# EAGLE design controller12 (EAGLE 8.3.1)

## Sheet 1 of 2
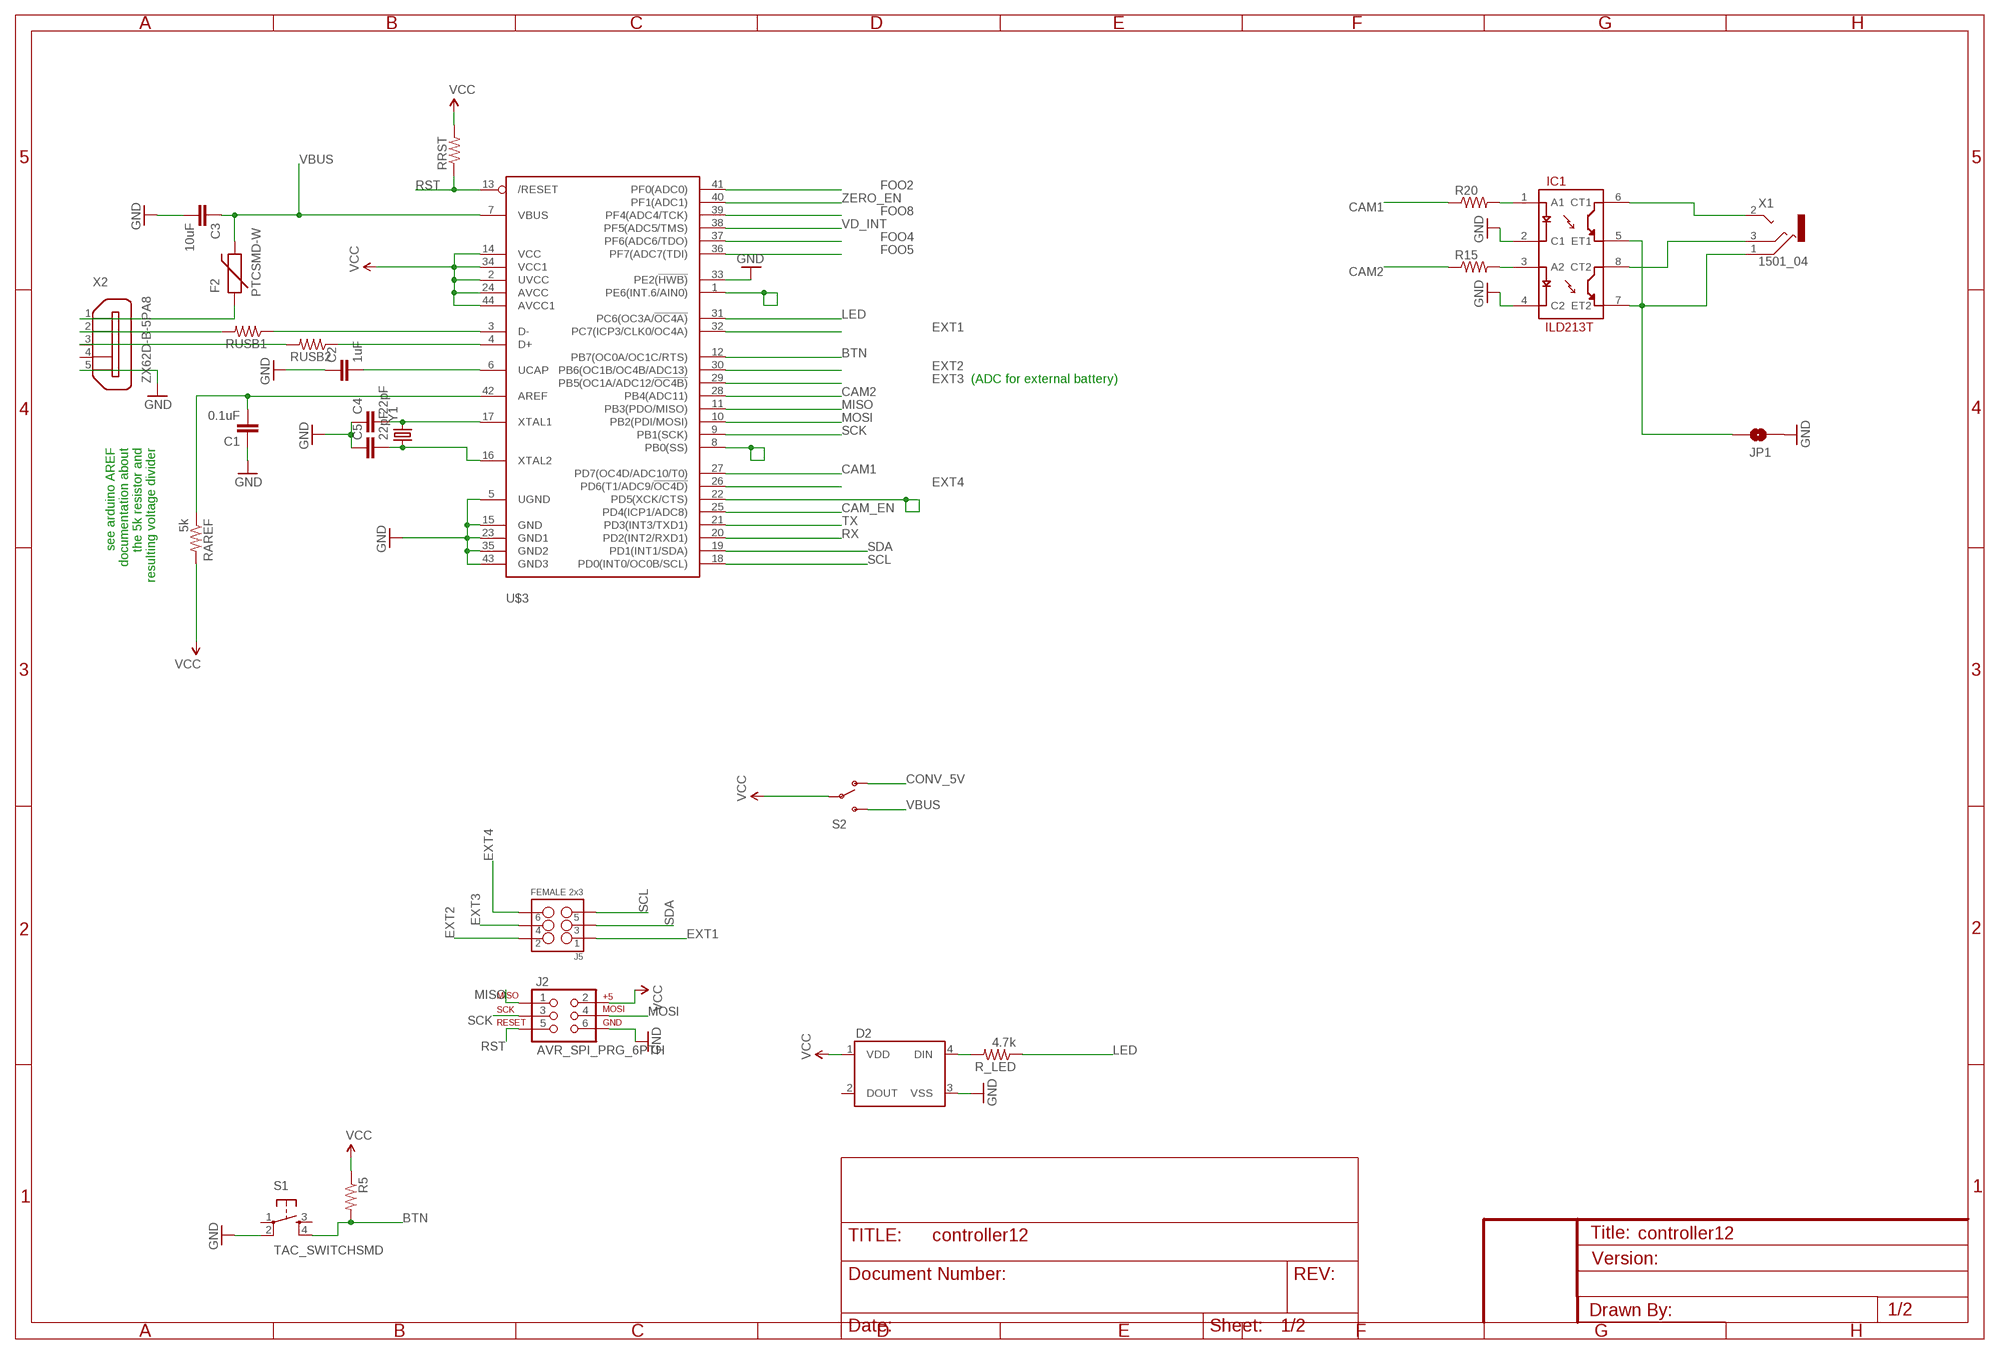
[diagram p0: schematic, sheet 1]

### Parts
C1  0.1uF  CAP1206  [1206]
C2  1uF  CAP1206  [1206]
C3  10uF  CAP1206  [1206]
C4  22pF  CAP1206  [1206]
C5  22pF  CAP1206  [1206]
D2  WS2812B  [WS2812B]
F2  PTCSMD-W  [PTC-1206-WIDE]
IC1  ILD213T  [SO08]
J2  AVR_SPI_PRG_6PTH  [2X3]
J5  FEMALE 2x3  M03X2FEMALE  [2X3]
JP1  JUMPER-PAD-2-NOYES_SILK  [PAD-JUMPER-2-NO_YES_SILK]
R5  RESISTOR1206  [1206]
R15  RESISTOR1206  [1206]
R20  RESISTOR1206  [1206]
R_LED  4.7k  RESISTOR1206  [1206]
RAREF  5k  RESISTOR1206  [1206]
RRST  RESISTOR1206  [1206]
RUSB1  RESISTOR1206  [1206]
RUSB2  RESISTOR1206  [1206]
S1  TAC_SWITCHSMD  TAC_SWITCHPTH  [TACTILE-PTH]
S2  SWITCH-SPDTSMD2  [SWITCH-SPDT-SMD]
U$3  ATMEGA32U4-AU  [TQFP44]
X1  1501_04  [1501_05]
X2  ZX62D-B-5PA8  [ZX62D-B-5PA8]
Y1  CRYSTALCRYSTAL-SMD-5X3-16MHZ  [CRYSTAL-SMD-5X3]

### Nets
BTN: R5.2 S1.4 U$3.12(PB7(OC0A/OC1C/RTS))
CAM1: R20.1 U$3.27(PD7(OC4D/ADC10/T0))
CAM2: R15.1 U$3.28(PB4(ADC11))
CAM_EN: U$3.25(PD4(ICP1/ADC8)) ; also sheet 2
CONV_5V [power]: S2.1(O) ; also sheet 2
EXT1: J5.1 U$3.32(PC7(ICP3/CLK0/OC4A))
EXT2: J5.2 U$3.30(PB6(OC1B/OC4B/ADC13))
EXT3: J5.4 U$3.29(PB5(OC1A/ADC12/!OC4B))
EXT4: J5.6 U$3.26(PD6(T1/ADC9/!OC4D))
FOO2: U$3.41(PF0(ADC0))
FOO4: U$3.37(PF6(ADC6/TDO))
FOO5: U$3.36(PF7(ADC7(TDI))
FOO8: U$3.39(PF4(ADC4/TCK))
GND: C1.1 C2.1 C3.2 C4.1 C5.1 D2.3(VSS) IC1.2(C1) IC1.4(C2) J2.6 JP1.1 S1.2 U$3.5(UGND) U$3.15(GND) U$3.23(GND1) U$3.33(PE2(!HWB)) U$3.35(GND2) U$3.43(GND3) X2.5 ; also sheet 2
LED: R_LED.1 U$3.31(PC6(OC3A/!OC4A))
MISO: J2.1 U$3.11(PB3(PDO/MISO))
MOSI: J2.4 U$3.10(PB2(PDI/MOSI))
N$4: RUSB1.1 U$3.3(D-)
N$5: RUSB2.1 U$3.4(D+)
N$7: D2.4(DIN) R_LED.2
N$8: C4.2 U$3.17(XTAL1) Y1.3
N$9: C5.2 U$3.16(XTAL2) Y1.1
N$10: RUSB1.2 X2.2
N$11: RUSB2.2 X2.3
N$12: IC1.6(CT1) X1.2
N$13: IC1.8(CT2) X1.3
N$14: U$3.8(PB0(SS))
N$15: IC1.3(A2) R15.2
N$16: U$3.1(PE6(INT.6/AIN0))
N$17: U$3.22(PD5(XCK/CTS))
N$18 [power]: C1.2 RAREF.1 U$3.42(AREF)
N$19: IC1.1(A1) R20.2
N$20: C2.2 U$3.6(UCAP)
N$34: IC1.5(ET1) IC1.7(ET2) JP1.2 X1.1
N$38: F2.1 X2.1
RST: J2.5 RRST.1 U$3.13(/RESET)
RX: U$3.20(PD2(INT2/RXD1)) ; also sheet 2
SCK: J2.3 U$3.9(PB1(SCK))
SCL: J5.5 U$3.18(PD0(INT0/OC0B/SCL))
SDA: J5.3 U$3.19(PD1(INT1/SDA))
TX: U$3.21(PD3(INT3/TXD1)) ; also sheet 2
VBUS: C3.1 F2.2 S2.3(S) U$3.7(VBUS)
VCC [power]: D2.1(VDD) J2.2 R5.1 RAREF.2 RRST.2 S2.2(P) U$3.2(UVCC) U$3.14(VCC) U$3.24(AVCC) U$3.34(VCC1) U$3.44(AVCC1) ; also sheet 2
VD_INT: U$3.38(PF5(ADC5/TMS)) ; also sheet 2
ZERO_EN: U$3.40(PF1(ADC1)) ; also sheet 2
Unconnected: D2.2(DOUT) S1.1 S1.3 X2.4 X2.S1 X2.S2 X2.S3 X2.S4

### Notes on the sheet
- (ADC for external battery)
- see arduino AREF
  documentation about
  the 5k resistor and
  resulting voltage divider

## Sheet 2 of 2
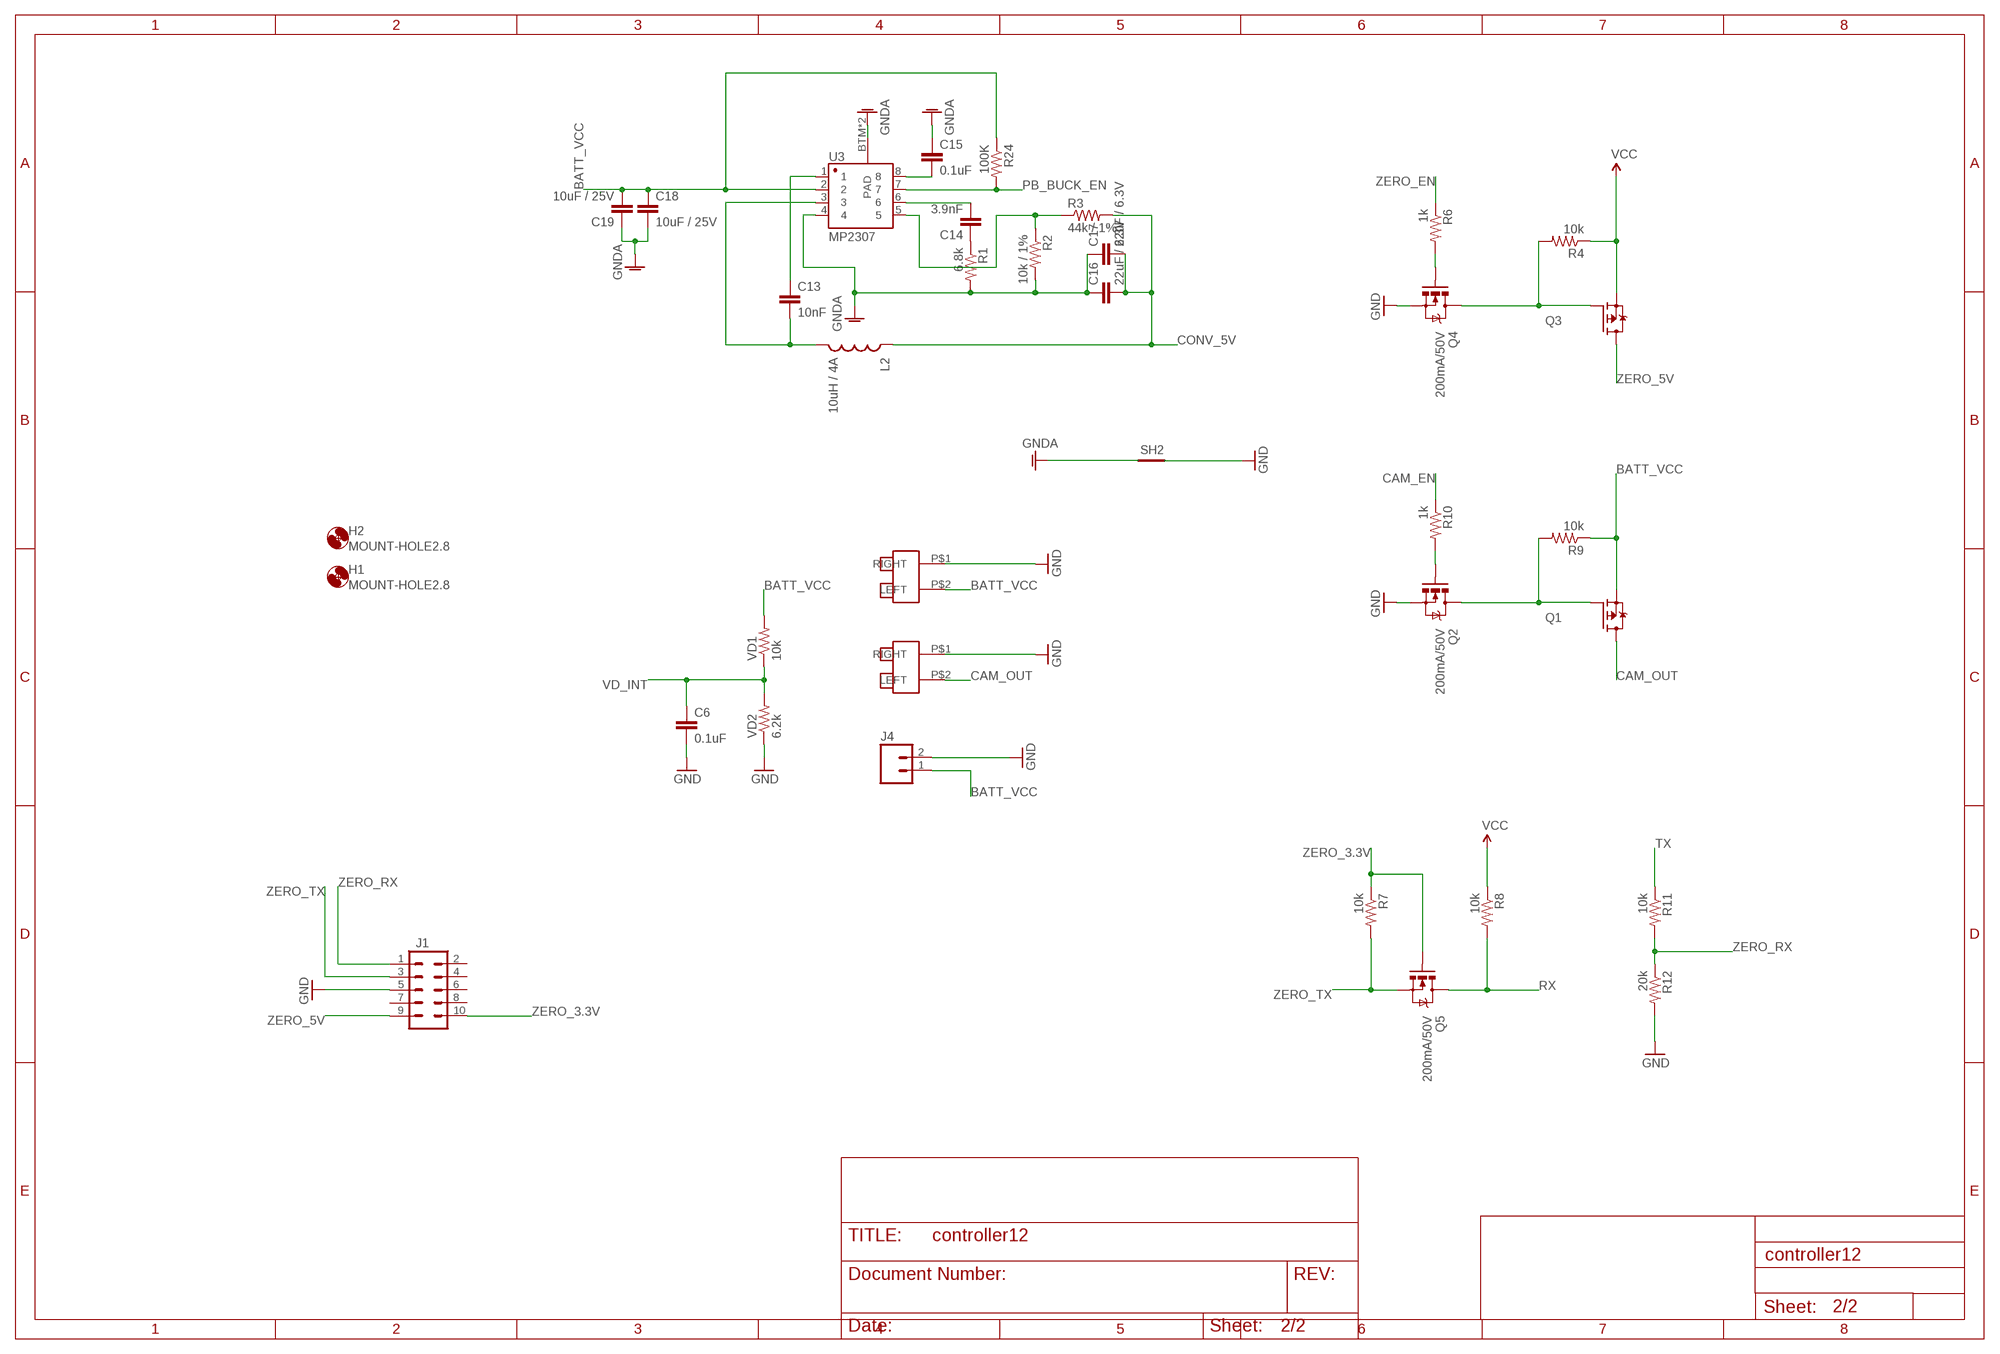
[diagram p1: schematic, sheet 2]

### Parts
C6  0.1uF  CAP1206  [1206]
C13  10nF  CAP1206  [1206]
C14  3.9nF  CAP1206  [1206]
C15  0.1uF  CAP1206  [1206]
C16  22uF / 6.3V  CAP1210  [1210]
C17  22uF / 6.3V  CAP1210  [1210]
C18  10uF / 25V  CAP1210  [1210]
C19  10uF / 25V  CAP1210  [1210]
H1  MOUNT-HOLE2.8  [2,8]
H2  MOUNT-HOLE2.8  [2,8]
J1  M05X2PTH  [AVR_ICSP]
J4  M02PTH  [1X02]
L2  10uH / 4A  INDUCTORSRU1038  [SRU1038]
Q1  FDD4141TO252  [TO252]
Q2  200mA/50V  MOSFET-NCHANNELBSS138  [SOT23-3]
Q3  FDD4141TO252  [TO252]
Q4  200mA/50V  MOSFET-NCHANNELBSS138  [SOT23-3]
Q5  200mA/50V  MOSFET-NCHANNELBSS138  [SOT23-3]
R1  6.8k  RESISTOR1206  [1206]
R2  10k / 1%  RESISTOR1206  [1206]
R3  44k / 1%  RESISTOR1206  [1206]
R4  10k  RESISTOR1206  [1206]
R6  1k  RESISTOR1206  [1206]
R7  10k  RESISTOR1206  [1206]
R8  10k  RESISTOR1206  [1206]
R9  10k  RESISTOR1206  [1206]
R10  1k  RESISTOR1206  [1206]
R11  10k  RESISTOR1206  [1206]
R12  20k  RESISTOR1206  [1206]
R24  100K  RESISTOR1206  [1206]
SH2  SHORT-HT5  [SHORT_TOP-50]
U3  MP2307  GENERIC-SOIC8MSGEQ7N-FILTER  [SO08]
U$4  NANOFIT2  [NANOFIT2]
U$5  NANOFIT2  [NANOFIT2]
VD1  10k  RESISTOR1206  [1206]
VD2  6.2k  RESISTOR1206  [1206]

### Nets
BATT_VCC [camera_power]: C18.1 C19.2 J4.1 Q1.2(S) R9.1 R24.1 U3.2 U$4.P$2(LEFT) VD1.2
CAM_EN: R10.1 ; also sheet 1
CAM_OUT [camera_power]: Q1.3(D) U$5.P$2(LEFT)
CONV_5V [power]: C16.2 C17.2 L2.1 R3.2 ; also sheet 1
GND: C6.2 J1.5 J4.2 Q2.2(S) Q4.2(S) R12.2 SH2.2 U$4.P$1(RIGHT) U$5.P$1(RIGHT) VD2.1 ; also sheet 1
GNDA [power]: C15.1 C16.1 C17.1 C18.2 C19.1 R1.2 R2.2 SH2.1 U3.4 U3.BTM(PAD) U3.P$1(PAD)
N$1: Q1.1(G) Q2.3(D) R9.2
N$2: Q4.1(G) R6.2
N$3: Q3.1(G) Q4.3(D) R4.2
N$6: Q2.1(G) R10.2
N$25: C15.2 U3.8
N$26 [power]: C13.2 L2.2 U3.3
N$27: C13.1 U3.1
N$28: C14.1 R1.1
N$29: C14.2 U3.6
N$30: R2.1 R3.1 U3.5
PB_BUCK_EN: R24.2 U3.7
RX: Q5.3(D) R8.2 ; also sheet 1
TX: R11.1 ; also sheet 1
VCC [power]: Q3.2(S) R4.1 R8.1 ; also sheet 1
VD_INT: C6.1 VD1.1 VD2.2 ; also sheet 1
ZERO_3.3V: J1.10 Q5.1(G) R7.1
ZERO_5V [power]: J1.9 Q3.3(D)
ZERO_EN: R6.1 ; also sheet 1
ZERO_RX: J1.1 R11.2 R12.1
ZERO_TX: J1.3 Q5.2(S) R7.2
Unconnected: J1.2 J1.4 J1.6 J1.7 J1.8

## Library data of the parts
C1 C2 C6 C13-C19 = SparkFun-Capacitors:CAP: Capacitor Standard 0603 ceramic capacitor, and 0.1" leaded capacitor.
C3-C5 = SparkFun-Passives:CAP: Capacitor Standard 0603 ceramic capacitor, and 0.1" leaded capacitor.
D2 = SparkFun-LED:WS2812B: WS2812B - Intelligent control LED integrated light source Technical Specifications: Power Supply Voltage (VDD): 3.5 to 5.3 V Input Voltage (VI): -0.5 to VDD+0.5 V Operating Junction Temperature (Topt): -25°C to +80°C Storage Temperature Range (Tstg): -55°C to +150°C; PROD_ID: DIO-12503
F2 = SparkFun-PowerIC:PTC: Resettable Fuse PTC Resettable Fuse. Spark Fun Electronics SKU : COM-08357
H1 H2 = holes:MOUNT-HOLE: MOUNTING HOLE with drill center marker
IC1 = SparkFun-DiscreteSemi:ILD213T: Dual optoisolator.
J1 = SparkFun-Connectors:M05X2: Header 5x2 Standard 10-pin dual row 0.1" header. Commonly used with AVR-ISP. Use with Spark Fun Electronics SKU: PRT-00778
J2 = SparkFun-Connectors:AVR_SPI_PRG_6: AVR ISP 6 Pin This is the reduced ISP connector for AVR programming. Common on Arduino. This footprint will take up less PCB space and can be used with a 10-pin to 6-pin adapter such as SKU: BOB-08508 **Special note about "TEST_POINT" package. The stop mask is on the top side, so if you want your programming test points to be on the bottom of your board, make sure to place this package on the bottom side of the board. This also ensure that the orientation to program from the bottom side will be correct.
J4 = SparkFun-Connectors:M02: Standard 2-pin 0.1" header. Use with - straight break away headers ( PRT-00116) - right angle break away headers (PRT-00553) - swiss pins (PRT-00743) - machine pins (PRT-00117) - female headers (PRT-00115) Molex polarized connector foot print use with: PRT-08233 with associated crimp pins and housings. 2.54_SCREWTERM for use with PRT-10571. 3.5mm Screw Terminal footprints for PRT-08084 5mm Screw Terminal footprints for use with PRT-08432
J5 = SparkFun-Connectors:M03X2: 2x3 .1" header. Shrouded, with keying- CONN-10681 SMT- CONN-11415 Pogo pins- HW-11044; PROD_ID: CONN-11566
JP1 = SparkFun-Passives:JUMPER-PAD-2-NO
L2 = SparkFun-Passives:INDUCTOR: Inductors Basic Inductor/Choke - 0603 and 1206. Footprints are not proven and vary greatly between part numbers. INDUCTOR POWER 3.3UH 4.0A SMD 0.197" L x 0.197" W x 0.177" H (5.00mm x 5.00mm x 4.50mm)
Q1 Q3 = transistor-fet:FDD4141: P-Channel PowerTrench® MOSFET Source: FDD4141.pdf
Q2 Q4 Q5 = SparkFun-DiscreteSemi:MOSFET-NCHANNEL: Common NMOSFET Parts MFG P/N Store ID Prod ID FDD8780 TRANS-09984 SI7820DN TRANS-11055 FDS6630A IC-08089 2N7002PW TRANS-11151 FQP30N06L COM-10213 TRANS-10060 BSS123LT1G TRANS-08345 BSS138 TRANS-00830 BS170 2N7000; PROD_ID: TRANS-00830
R1-R4 R6-R12 R24 R_LED = SparkFun-Resistors:RESISTOR: Resistor Basic schematic elements and footprints for 0603, 1206, and PTH resistors.
R5 R15 R20 RAREF RRST RUSB1 RUSB2 VD1 VD2 = SparkFun-Passives:RESISTOR: Resistor Basic schematic elements and footprints for 0603, 1206, and PTH resistors.
S1 = SparkFun-Retired:TAC_SWITCH: Momentary Switch Button commonly used for reset or general input. Spark Fun Electronics SKU : COM-00097 SMT- SWCH-08247
S2 = SparkFun-Electromechanical:SWITCH-SPDT: SPDT Switch Simple slide switch, Spark Fun Electronics SKU : COM-00102 DPDT SMT slide switch, AYZ0202, SWCH-08179
SH2 = shorts:SHORT-H: Short between two nets; BOM: no
U3 = SparkFun-AnalogIC:GENERIC-SOIC8: A placeholder for generic narrow & wide SOIC8 foorptints - used on the DIP adapter board.; PROD_ID: IC-10141
U$3 = adafruit:ATMEGA32U4: http://www.ladyada.net/library/eagle
U$4 U$5 = volzolib:NANOFIT2
X1 = con-lumberg:1501_0*: Jack connectors according to JISC 6560, 2.5 mm Klinkensteckverbinder nach JISC 6560, 2,5 mm Source: http://www.lumberg.com/Produkte/PDFs/1501_05.pdfedit 1501_03 http://www.lumberg.com/Produkte/PDFs/1501_06.pdf; OC_FARNELL: 1216977; OC_NEWARK: unknown
X2 = zx62d-b-5pa8-oshpark_10:ZX62D-B-5PA8: Micro USB Type B Connector - Standard, Shell Through Hole Source: http://www.hirose.co.jp/cataloge_hp/ed_ZX_20140804.pdf; MF: Hirose; MPN: ZX62D-B-5PA8; OC_FARNELL: 2300438; OC_NEWARK: 69W0712
Y1 = SparkFun-FreqCtrl:CRYSTAL: Various standard crystals. Proven footprints.; PROD_ID: XTAL-08218

## Net classes
0 default: width 0.254 mm, clearance 0.254 mm
1 power: width 0.381 mm, clearance 0.254 mm
2 camera_power: width 0.66 mm, clearance 0.254 mm
3 usbsignal: width 0.254 mm, clearance 0.203 mm

## Board
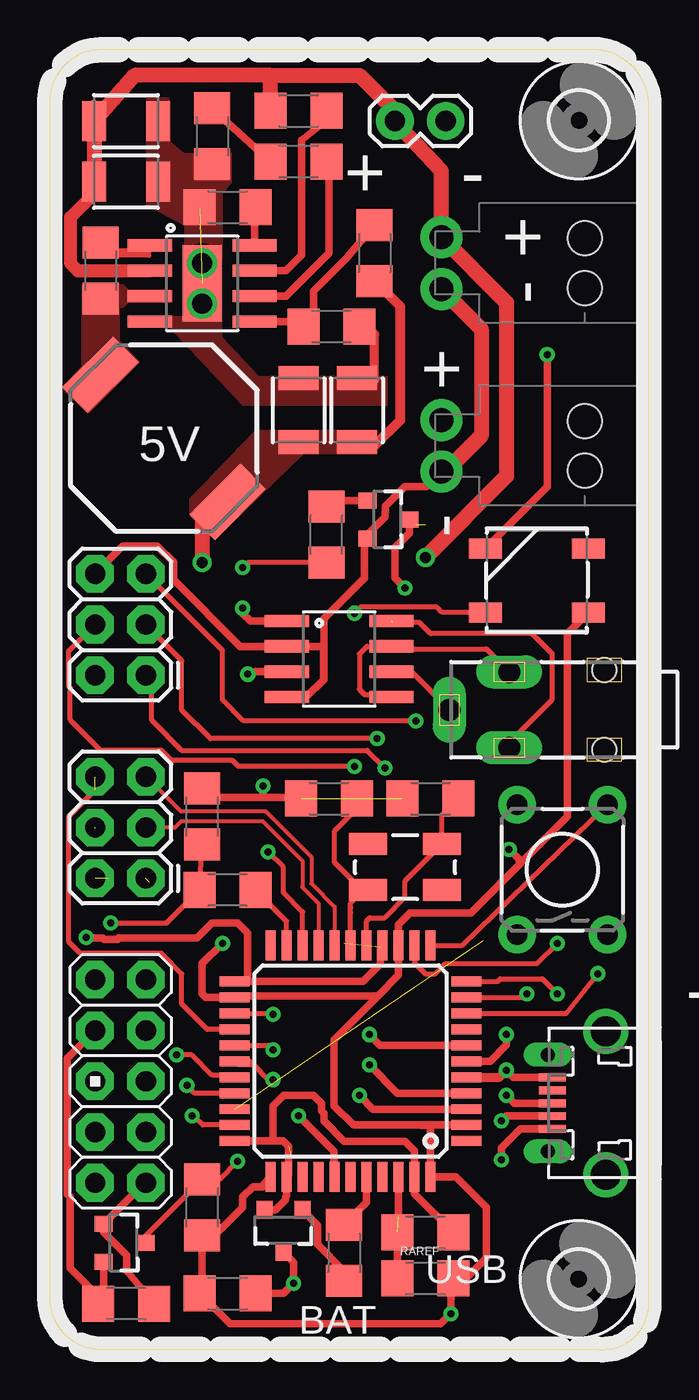
[diagram p2: board, top side]
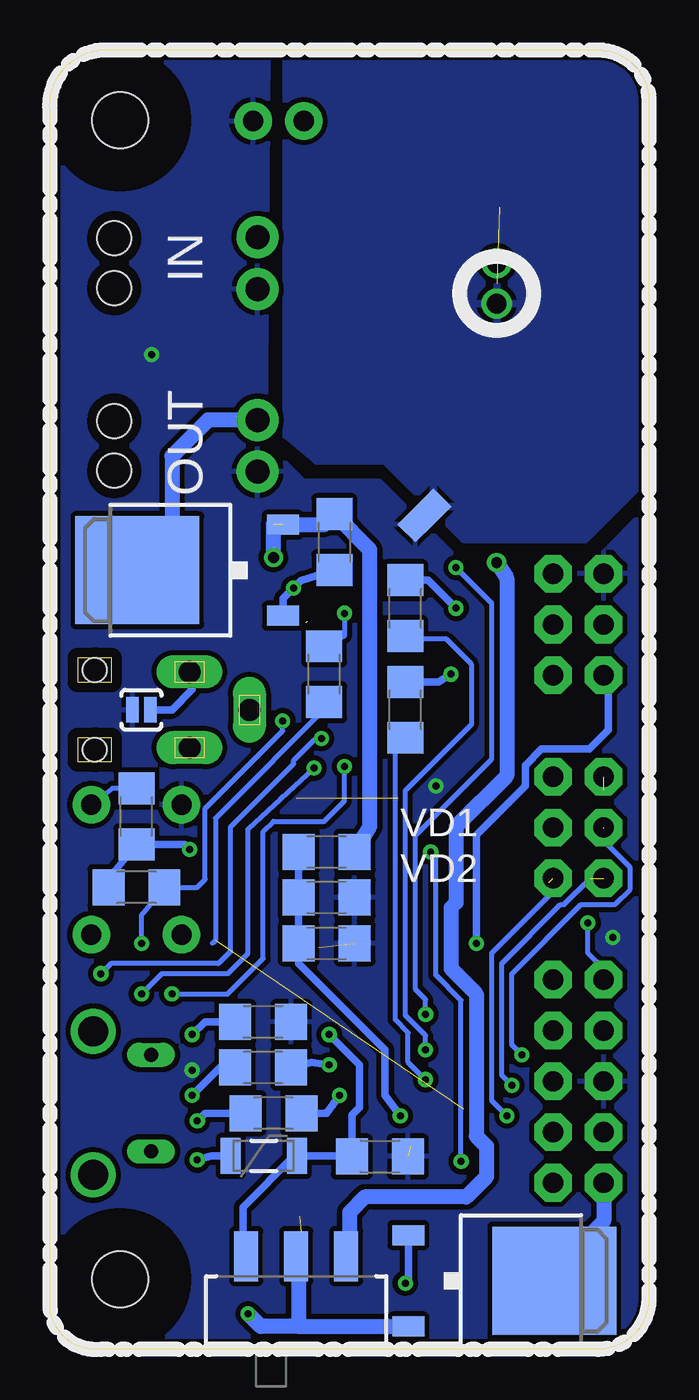
[diagram p3: board, bottom side, seen from below]

Size 29.98 x 65.04 mm. Coordinates in mm from the lower left corner, seen from the top.
Outline: 0,2.55 arc90 2.54,0.01 27.43,0.01 arc90 29.97,2.05 29.97,61.99 arc90 27.43,65.04 2.54,65.04 arc90 0,62.5 0,2.55
Copper layers (1*16): Top 0.035mm / dielectric 1.5mm / Bottom 0.035mm
Design rules "default *": minimum track width 10mil, minimum drill 24mil, track to track 8mil, track to pad 8mil, pad to pad 8mil, via to via 8mil, smd to smd 8mil, copper to edge 20mil, drill to drill 8mil, minimum pad ring 10mil, minimum via ring 8mil, stop-mask expansion 4mil, vias tented up to drill 0mil, thermal gap 10mil

### Footprints (pad centres in the part's own frame; a part is rotated, then mirrored left to right if it is on the bottom)
1206 = smd 1.6 x 1.8: 1 -1.4,0; 2 1.4,0
1210 = smd 1.2 x 2: 1 -1.6,0; 2 1.6,0
WS2812B = smd 1.651 x 1: 1 -2.577,1.6; 2 -2.577,-1.6; 3 2.577,-1.6; 4 2.577,1.6
PTC-1206-WIDE = smd 1 x 1.8: 1 -1.654,0; 2 1.654,0
2,8 = hole 2.8: 0,0
SO08 = smd 0.61 x 2.21: 1 -1.905,-2.616; 2 -0.635,-2.616; 3 0.635,-2.616; 4 1.905,-2.616; 5 1.905,2.616; 6 0.635,2.616; 7 -0.635,2.616; 8 -1.905,2.616
AVR_ICSP = drill 1.016 pad 1.88 octagon: 1 -1.27,5.08; 2 1.27,5.08; 3 -1.27,2.54; 4 1.27,2.54; 5 -1.27,0; 6 1.27,0; 7 -1.27,-2.54; 8 1.27,-2.54; 9 -1.27,-5.08; 10 1.27,-5.08
2X3 = drill 1.016 pad 1.88 octagon: 1 0,0; 2 0,2.54; 3 2.54,0; 4 2.54,2.54; 5 5.08,0; 6 5.08,2.54
1X02 = drill 1.016 pad 1.88: 1 0,0; 2 2.54,0
PAD-JUMPER-2-NO_YES_SILK = smd 0.635 x 1.27: 1 -0.45,0; 2 0.45,0
SRU1038 = smd 1.8 x 3.6: 1 -4.5,0; 2 4.5,0
TO252 = smd 1 x 1.6: 1 -2.28,-4.8; 2 2.28,-4.8 | smd 5.4 x 6.2: 3 0,2.5
SOT23-3 = smd 0.8 x 0.9: 1 -0.95,-1; 2 0.95,-1; 3 0,1.1
TACTILE-PTH = drill 1.016 pad 1.88: 1 -3.251,2.261; 2 3.251,2.261; 3 -3.251,-2.261; 4 3.251,-2.261
SWITCH-SPDT-SMD = smd 1.2 x 2.5: 1 -2.5,-2.75; 2 0,-2.75; 3 2.5,-2.75
SHORT_TOP-50 = smd 1.27 x 1.27: 1 0.635,0; 2 -0.635,0
SO08' = smd 0.61 x 2.21: 1 -1.905,-2.616; 2 -0.635,-2.616; 3 0.635,-2.616; 4 1.905,-2.616; 5 1.905,2.616; 6 0.635,2.616; 7 -0.635,2.616; 8 -1.905,2.616 | smd 3.81 x 1.93: BTM 0,0 | drill 1: P$1 1.016,0; P$2 -1.016,0
TQFP44 = smd 1.5 x 0.5: 1 -5.8,4; 2 -5.8,3.2; 3 -5.8,2.4; 4 -5.8,1.6; 5 -5.8,0.8; 6 -5.8,0; 7 -5.8,-0.8; 8 -5.8,-1.6; 9 -5.8,-2.4; 10 -5.8,-3.2; 11 -5.8,-4; 23 5.8,-4; 24 5.8,-3.2; 25 5.8,-2.4; 26 5.8,-1.6; 27 5.8,-0.8; 28 5.8,0; 29 5.8,0.8; 30 5.8,1.6; 31 5.8,2.4; 32 5.8,3.2; 33 5.8,4 | smd 0.5 x 1.5: 12 -4,-5.8; 13 -3.2,-5.8; 14 -2.4,-5.8; 15 -1.6,-5.8; 16 -0.8,-5.8; 17 0,-5.8; 18 0.8,-5.8; 19 1.6,-5.8; 20 2.4,-5.8; 21 3.2,-5.8; 22 4,-5.8; 34 4,5.8; 35 3.2,5.8; 36 2.4,5.8; 37 1.6,5.8; 38 0.8,5.8; 39 0,5.8; 40 -0.8,5.8; 41 -1.6,5.8; 42 -2.4,5.8; 43 -3.2,5.8; 44 -4,5.8
NANOFIT2 = drill 1.2 pad 2.1: P$1 10.38,1.3; P$2 10.38,-1.3 | hole 1.7: 3.2,1.25; 3.2,-1.25
1501_05 = drill 1.1 pad 1.4 long: 1 -1.9,-8.5; 2 0,-11.5; 3 1.9,-8.5 | hole 1.2: -2,-3.75; 2,-3.75
ZX62D-B-5PA8 = smd 1.35 x 0.4: 1 4.825,1.3; 2 4.825,0.65; 3 4.825,0; 4 4.825,-0.65; 5 4.825,-1.3 | drill 1.5: S1 2.15,-3.6; S2 2.15,3.6 | drill 0.7 long: S3 5.05,2.425; S4 5.05,-2.425
CRYSTAL-SMD-5X3 = smd 1.9 x 1.1: 1 -1.85,-1.15; 2 1.85,-1.15; 3 1.85,1.15; 4 -1.85,1.15

### Placement (x,y rotation side)
C1  18.8,5.86 180 top
C2  19.3,16.4 180 bottom
C3  13.46,9.67 0 bottom
C4  13.97,27.57 0 top
C5  19.05,27.57 0 top
C6  16.13,20.33 0 bottom
C13  2.54,53.99 270 top
C14  12.45,59.45 0 top
C15  8.89,57.16 0 top
C16  15.37,47 270 top
C17  12.45,47 270 top
C18  3.81,61.48 0 top
C19  3.81,58.43 180 top
D2  24.38,38.49 180 top
F2  19.28,9.69 0 bottom
H1  26.47,3.52 0 top
H2  26.48,61.52 0 top
IC1  14.48,34.56 270 top
J1  3.53,13.42 0 top
J2  4.8,33.74 90 top
J4  17.27,61.48 0 top
J5  4.8,23.58 90 top
JP1  25.4,32.02 0 bottom
L2  5.71,45.61 135 top
Q1  23.11,39 90 bottom
Q2  16.89,41.54 270 top
Q3  7.24,3.44 270 bottom
Q4  11.68,5.98 180 top
Q5  3.68,5.35 270 top
R1  8.13,60.72 270 top
R2  14.1,51.19 0 top
R3  16.26,54.88 270 top
R4  8.89,2.81 0 top
R5  25.65,26.68 90 bottom
R6  14.73,4.84 270 top
R7  3.81,2.3 180 top
R8  7.62,7.13 90 top
R9  15.75,40.4 270 bottom
R10  13.84,40.78 90 top
R11  8.89,23 180 top
R12  7.62,26.68 90 top
R15  12.19,32.02 90 bottom
R20  12.19,37.1 90 bottom
R24  12.45,61.99 0 top
R_LED  16.26,33.8 90 bottom
RAREF  18.8,3.57 0 top
RRST  25.65,23.13 180 bottom
RUSB1  18.8,11.82 180 bottom
RUSB2  19.3,14.11 180 bottom
S1  25.65,24.02 90 top
S2  17.65,1.92 180 bottom
SH2  11.23,41.75 45 bottom
U3  MP2307  [SO08']  7.62,53.35 270 top
U$3  15.05,14.43 180 top
U$4  29.97,54.37 180 top
U$5  29.97,45.23 180 top
VD1  16.13,24.91 0 bottom
VD2  16.13,22.62 180 bottom
X1  31.5,32.02 270 top
X2  29.97,12.33 180 top
Y1  17.78,24.14 180 top

### Tracks (layer width: path | path; a pad name or v marks a point on that pad's centre or on a via)
BATT_VCC  (via drill 0.55)  (1 unrouted)
  Top 0.66: 2.29,57.93 C19.2 2.03,57.67 1.02,56.66 1.02,54.37 1.4,53.99 U3.2 | 2.29,61.74 C18.1
  Top 0.762: 2.21,61.66 C19.2 | 2.21,61.66 2.29,61.74 | 2.41,61.74 C18.1 4.24,63.77 11.05,63.77 | 2.21,62.17 2.21,61.66 | v18.8,39.64 22.86,43.7 22.86,52.4 U$4.P$2 19.59,58.98 J4.1 17.27,61.99 15.49,63.77 11.05,63.77 | R24.1 11.05,63.76 11.05,63.77
  Bottom 0.762: VD1.2 13.97,26.18 13.97,40.02 R9.1 16.27,41.28 Q1.2 18.18,41.15 | v18.8,39.64 18.8,41.29
BTN
  Top 0.254: U$3.12 20.62,20.23 S1.4
  Bottom 0.254: R5.2 26.84,28.08 S1.4
CAM1  (via drill 0.35)
  Top 0.254: U$3.27 10.94,15.23 v11.18,15
  Bottom 0.254: R20.1 12.07,35.57 10.16,35.57 8.89,34.3 8.89,31.27 12.19,27.97 12.19,16.72 11.18,15.71 v11.18,15
CAM2  (via drill 0.35)
  Top 0.254: 10,14.43 U$3.28 9.42,14.26 10.16,14.26 10.92,13.51 v11.18,13.51
  Bottom 0.254: 12.21,30.59 12.7,29.86 | 12.21,30.59 R15.1 | v11.18,13.51 12.05,14.38 12.05,15.86 12.7,16.51 12.7,30.1 12.21,30.59
CAM_EN  (via drill 0.35)
  Top 0.254: U$3.25 11.12,16.83 v11.17,16.78 | R10.1 9.9,39.38 v9.65,39.13
  Bottom 0.254: v9.65,39.13 7.87,37.35 7.87,29.54 11.68,25.73 11.68,18.03 11.17,17.52 v11.17,16.78
CAM_OUT
  Bottom 0.762: U$5.P$2 22.07,46.53 23.88,44.72 23.88,39.47 Q1.3
CONV_5V  (via drill 0.55)
  Top 0.508: R3.2 17.53,52.21 17.53,46.5 16.26,45.23 16.05,45.23 C16.2
  Top 0.762: 7.61,41.92 L2.1 | 8.13,41.93 7.61,41.92 | 7.61,41.92 7.61,40.89 7.62,40.91 v7.62,39.38
  Bottom 0.762: v7.62,39.38 7.11,38.62 7.11,28.72 9.65,26.18 9.65,22.37 9.91,22.11 9.91,19.06 8.64,17.79 8.64,10.68 8.13,10.17 8.13,8.65 9.14,7.63 14.22,7.63 14.99,6.87 14.99,5.09 S2.1
  pour Top (no thermals): 16.38,45.99 10.29,45.99 6.99,42.56 6.99,41.8 8.26,40.53 12.7,44.84 16.38,44.84 16.26,45.23
EXT1  (via drill 0.35)  (1 unrouted)
  Top 0.254: U$3.32 7.66,11.23 v7.11,11.7
  Bottom 0.254: 5,23.38 4.83,22.87 7.87,19.83 7.87,12.46 v7.11,11.7
EXT2  (via drill 0.35)  (1 unrouted)
  Top 0.254: U$3.30 7.25,12.83 v6.86,13.22
  Bottom 0.254: v6.86,13.22 7.37,13.73 7.37,19.32 4.42,22.26 4.25,22.26 2.93,23.58
EXT3  (via drill 0.35)  (1 unrouted)
  Top 0.254: U$3.29 9.16,13.73 8.13,13.73 7.11,14.75 v6.35,14.75
  Bottom 0.254: v6.35,14.75 6.86,15.25 6.86,18.81 3.4,22.26 1.71,22.26 0.94,23.04 0.94,24.13 2.26,25.45 2.26,26.08
EXT4  (1 unrouted)
  Top 0.254: U$3.26 9.24,16.02 7.87,16.02 6.6,17.29 6.6,18.81 5.59,19.83 1.52,19.83 0.94,20.41 0.94,26.67 2.26,27.99
GND  (via drill 0.35)  (3 unrouted)
  Top 0.254: Q2.2 15.89,40.83 | 16.76,20.34 U$3.15
  Top 0.381: X2.5 23.21,13.63 v22.86,13.98 | D2.3 24.89,43.18 v24.89,49.8 | IC1.4 12.83,32.65 13.72,33.54 | J2.6 3.65,40.21 5.37,40.21 6.18,39.4 6.18,38.53 9.53,35.19 IC1.2 12.88,35.19 13.72,35.19 13.72,36.59 15.75,38.62 15.75,40.45 Q2.2 15.89,40.8 16.76,41.67 16.76,41.89 16.79,41.91 16.79,42.2 17.78,43.19 18.86,43.19 19.49,43.82 U$5.P$1 | U$3.15 16.55,20.13 16.55,19.3 15.68,18.43 U$3.23 9.91,18.43 9.91,20.84 9.4,21.35 8.13,21.35 7.37,20.59 3.45,20.59 3.39,20.52 2.71,20.52 2.64,20.59 2.06,20.59 | 8.09,27.62 R12.2 | 8.09,27.62 8.23,27.47 | C4.1 12.53,27.62 10.67,27.62 | 10.67,27.62 8.09,27.62 | 10.67,27.62 v10.67,28.21 | 1.78,20.59 2.06,20.59 | 2.06,20.59 v1.81,20.62 | 11.01,10.43 U$3.33 | 11.01,10.43 11.68,10.43 11.94,10.17 11.94,8.72 U$3.35 11.85,7.68 11.79,7.62 11.79,7.48 11.29,6.98 Q4.2 | C1.1 18.25,7.8 U$3.43 18.25,9.95 17.78,10.43 14.73,10.43 13.72,11.44 13.72,11.82 13.59,11.94 13.59,12.33 13.21,12.71 11.68,12.71 11.18,12.21 11.18,10.6 11.01,10.43
  Top 0.406: 13.72,33.54 13.72,35.19
  Top 0.457: U$3.5 22.51,13.63 v22.86,13.98
  Top 0.762: U$4.P$1 21.59,51.07 21.59,45.73 19.68,43.82 19.49,43.82
  pour Bottom: 29.84,0.01 0,0.01 0,42.18 2.54,39.64 9.65,39.64 13.46,43.45 17.27,43.45 19.18,45.35 19.05,65.16 29.84,65.04
GNDA  (1 unrouted)
  Top 0.457: R2.2 16.26,50.81 16.26,48.53 C16.1
  pour Top (no thermals): 16.89,48.68 10.44,48.68 8.61,50.64 8.64,57.93 9.09,58.38 9.09,59.88 6.71,59.86 5.97,60.47 5.97,62.62 4.83,62.62 4.83,57.29 6.73,56.27 6.73,51.7 5.97,51.7 5.97,51.19 9.65,47.26 16.89,47.26
  pour Bottom: 0,65.29 0,43.7 3.17,40.53 9.27,40.53 13.21,44.46 16.64,44.46 18.16,45.73 18.16,65.29
LED  (1 unrouted)
  Bottom 0.254: R_LED.1 15.88,32.4 21.7,26.58 21.7,20.48 21.84,20.33
MISO  (via drill 0.35)
  Top 0.254: U$3.11 22.43,18.43 22.55,18.55 24.64,18.55 v25.4,17.79 | J2.1 5.08,33.47 5.08,31.51 6.6,29.99 15.88,29.99 v16.76,29.1
  Bottom 0.254: 18.41,27.58 20.07,26.05 20.07,19.83 21.08,18.81 24.38,18.81 v25.4,17.79 | 18.41,27.58 18.29,27.7 | 18.41,27.58 v16.76,29.1
MOSI  (via drill 0.35)
  Top 0.254: U$3.10 23.71,17.63 v23.88,17.79 | v15.24,29.18 9.44,29.18 9.14,29.48 6.1,29.48 5.59,29.99 2.54,29.99 1.02,31.51 1.02,33.12 0.94,33.2 0.94,34.96 J2.4
  Bottom 0.254: v23.88,17.79 21.08,17.79 19.3,19.57 19.3,25.92 18.8,26.43 16.26,26.43 15.24,27.45 v15.24,29.18
N$1  (via drill 0.35)
  Top 0.381: Q2.3 17.99,40.86 17.27,40.15 17.27,38.62 v17.78,38.11
  Bottom 0.381: R9.2 17.4,38.49 v17.78,38.11 18.31,37.58 Q1.1
N$2
  Top 0.381: Q4.1 13.39,6.23 13.39,5.26 14.73,3.91 R6.2
N$3  (via drill 0.35)
  Top 0.381: R4.2 11.68,2.81 v12.19,3.32 12.19,4.37 Q4.3
  Bottom 0.381: Q3.1 12.04,3.47 v12.19,3.32
N$4  (via drill 0.35)
  Top 0.381: U$3.3 16.18,12.03 v15.49,12.71
  Bottom 0.381: RUSB1.1 16.13,11.82 v15.49,12.71
N$5  (via drill 0.35)
  Top 0.381: U$3.4 17.41,12.83 v16,14.24
  Bottom 0.381: RUSB2.1 16.89,14.36 v16,14.24
N$6
  Top 0.381: Q2.1 14.04,42.49 R10.2
N$7  (via drill 0.35)
  Top 0.254: 21.55,37.15 D2.4 19.63,36.89 19.37,37.15 15.54,37.15 v15.24,36.84
  Bottom 0.254: v15.24,36.84 15.24,35.7 R_LED.2
N$8
  Top 0.254: U$3.17 15.05,21.86 | 15.05,21.86 15.05,22.12 | C4.2 15.37,27.07 14.22,25.92 14.22,24.4 15.24,23.38 15.54,23.38 15.82,23.11 | 15.82,23.11 Y1.3 | 15.05,21.86 15.05,22.34 15.82,23.11
N$9
  Top 0.254: C5.2 19.63,26.75 Y1.1 17.78,23.44 17.78,22.62 16.76,21.6 16,21.6 15.85,21.46 U$3.16
N$10  (via drill 0.35)
  Top 0.381: X2.2 22.84,11.68 v22.61,11.44
  Bottom 0.381: 20.45,11.57 RUSB1.2 22.23,11.82 v22.61,11.44
N$11  (via drill 0.35)
  Top 0.381: X2.3 23.24,12.33 v22.86,12.71
  Bottom 0.381: RUSB2.2 21.46,14.11 v22.86,12.71
N$12
  Top 0.254: IC1.6 18.09,33.92 X1.2
N$13  (1 unrouted)
  Top 0.254: X1.3 23,30.38 25.15,32.53 25.15,34.81 24.38,35.57 24.13,35.83 19.05,35.83 18.49,36.39 17.17,36.39
N$15  (via drill 0.35)
  Top 0.381: IC1.3 10.29,33.92 v9.91,33.8
  Bottom 0.381: R15.2 10.54,33.42 v9.91,33.8
N$18  (1 unrouted)
  Top 0.381: U$3.42 17.45,6.67 | RAREF.1 C1.2
N$19  (via drill 0.35)
  Top 0.381: IC1.1 10.03,36.46 9.65,36.84 v9.65,37.1
  Bottom 0.381: R20.2 11.05,38.5 v9.65,37.1
N$20  (via drill 0.35)
  Top 0.381: U$3.6 22.04,14.43 22.86,15.25 v22.86,15.76
  Bottom 0.381: 20.32,17.03 C2.2 | 20.83,16.27 C2.2 | C2.2 22.23,16.4 v22.86,15.76
N$25
  Top 0.381: U3.8 10.24,56.6 C15.2
N$26
  pour Top (no thermals): 5.97,52.97 3.94,52.97 3.68,53.23 1.65,53.23 1.65,49.16 0.64,48.15 1.91,46.88 4.45,49.42 3.43,50.43 3.43,52.21 3.68,52.21 3.94,52.46 5.97,52.46
N$27
  Top 0.254: 4.83,54.88 4.95,54.75 U3.1 | 2.54,54.88 C13.1
  Top 0.457: 4.83,54.88 2.54,54.88
N$28
  Top 0.381: R1.1 8.38,61.87 C14.1
N$29
  Top 0.381: C14.2 13.97,59.07 13.97,54.88 11.81,52.72 U3.6
N$30
  Top 0.381: 12.95,50.94 R2.1 13.21,51.34 | 13.21,51.34 13.21,52.96 14.86,54.61 14.86,54.63 R3.1 | U3.5 13.09,51.45 13.21,51.34
N$34
  Top 0.254: IC1.5 16.97,32.78 15.75,32.78 15.49,33.03 15.49,34.81 15.88,35.19 IC1.7 17.95,35.19 18.08,35.07 21.85,35.07 X1.1
  Bottom 0.381: JP1.2 23.88,32.02 22.86,33.03 22.86,33.78 X1.1
N$38  (via drill 0.35)
  Top 0.381: X2.1 24.62,11.04 23.55,11.04 22.61,10.1 v22.61,9.48
  Bottom 0.381: F2.1 21.89,9.69 v22.61,9.48
PB_BUCK_EN
  Top 0.381: R24.2 13.85,61.52 12.6,60.53 12.6,54.78 11.81,53.99 U3.7
RST  (via drill 0.35)
  Top 0.254: U$3.13 18.25,19.35 18.8,18.81 19.3,18.81 19.81,19.32 24.38,19.32 v25.4,20.33 | v18.33,31.46 9.7,31.46 8.64,32.53 8.64,34.99 J2.5
  Bottom 0.254: 4.88,38.82 J2.5 | v25.4,20.33 25.4,21.73 RRST.1 22.61,23.13 22.2,23.53 22.2,27.09 18.33,30.96 v18.33,31.46
RX  (via drill 0.35)
  Top 0.254: U$3.20 12.65,21.9 11.68,22.87 11.68,24.14 v10.92,24.91 | Q5.3 4.78,5.69 R8.2 8.51,8.53 v9.4,9.41
  Bottom 0.254: v9.4,9.41 9.4,17.48 10.67,18.75 10.67,24.65 v10.92,24.91
SCK  (via drill 0.35)
  Top 0.254: U$3.9 25.85,16.83 v27.43,18.81 | v16.38,30.58 8.04,30.58 6.6,32.02 6.6,34.48 J2.3
  Bottom 0.254: v16.38,30.58 16.47,30.49 16.76,30.49 17.78,29.48 17.78,29.31 20.93,26.15 20.93,19.93 21.55,19.32 26.92,19.32 v27.43,18.81
SCL
  Top 0.203: J5.5 4.84,28.66 6.57,26.93 10.82,26.93 13.1,24.65 13.1,23.32 14.25,22.16 U$3.18
SDA
  Top 0.203: J5.3 6.26,26.12 6.57,26.44 10.66,26.44 12.64,24.46 12.64,23.13 13.45,22.32 U$3.19
TX
  Top 0.254: U$3.21 11.85,21.44 R11.1
VBUS  (via drill 0.35)
  Top 0.381: v16,15.76 16.53,15.23 U$3.7
  Bottom 0.381: 14.9,9.69 15.39,9.94 | 14.9,9.69 C3.1 14.86,11.75 14.48,12.13 14.48,14.24 v16,15.76 | S2.3 20.32,4.84 20.32,7.13 17.75,9.69 F2.2 17.11,9.69 14.9,9.69
VCC  (via drill 0.35)
  Top 0.381: U$3.2 18,11.23 | 18,11.23 19.05,11.2 U$3.44 19.07,8.65 20.32,8.65 21.84,7.13 21.84,4.59 20.83,3.57 RAREF.2 20.07,3.44 v20.07,1.79 19.56,1.28 9.65,1.28 | D2.1 25.91,35.84 25.91,26.68 23.5,24.27 | 18,11.23 15.2,11.23 14.22,12.21 14.22,15.51 16.41,17.7 | 16.41,17.7 17.45,18.74 U$3.14 17.45,21.28 18.03,21.86 21.08,21.86 23.5,24.27 | v8.64,20.33 7.62,19.32 7.62,17.79 7.78,17.63 U$3.24 9.32,17.7 16.41,17.7 | 23.5,24.27 23.5,24.52 v22.99,25.03 | 9.65,1.28 9.52,1.28 | U$3.34 10.67,8.25 10.67,8.14 10.16,8.14 9.65,7.63 9.65,7.13 8.25,5.73 R8.1 7.62,2.94 R4.1 9.01,1.28 9.65,1.28
  Bottom 0.381: 2.26,33.16 J2.2 2.03,33.52 2.03,31 2.98,30.05 5.37,30.05 6.18,29.24 6.18,28.2 8.64,25.75 v8.64,20.33 | RRST.2 26.8,23.88 R5.1 23.24,25.28 v22.99,25.03
  Bottom 0.762: S2.2 17.53,4.54 17.53,1.16 | v20.07,1.79 19.44,1.16 17.53,1.16 | 17.53,1.16 Q3.2 | 17.53,1.16
VD_INT  (via drill 0.35)
  Top 0.381: U$3.38 14.22,9.17 14.22,9.92 v12.45,11.7
  Bottom 0.381: VD1.1 VD2.2 C6.1 17.53,19.32 13.21,15 13.21,12.71 v12.45,11.7
ZERO_3.3V
  Top 0.381: J1.10 4.73,8.34 Q5.1 2.68,5.88 3.83,4.73 3.83,3.93 R7.1
ZERO_5V
  Bottom 0.381: 4.74,4.08 4.74,3.97 Q3.3 4.74,2.21 4.57,2.05
  Bottom 0.457: 2.29,8.32 J1.9
  Bottom 0.762: J1.9 2.26,6.43 4.72,3.97 4.74,3.97
ZERO_EN
  Top 0.381: U$3.40 15.85,7.36 R6.1
ZERO_RX  (via drill 0.35)
  Top 0.254: v3.05,21.35 5.84,21.35 R11.2 R12.1
  Bottom 0.254: J1.1 2.26,19.04 3.05,19.83 v3.05,21.35
ZERO_TX
  Top 0.381: J1.3 0.88,14.58 0.88,13.43 0.88,7.77 1.02,7.63 1.02,4.08 2.79,2.3 R7.2 2.68,2.83 Q5.2

### Text on the board
tPlace: + | - | + | - | + | 5V | - | TIME | BOX | 12 | USB | BAT
bPlace: IN | OUT | VD1 | VD2